# Altium schematic sheet DAC.SchDoc: Наименование
size 209 x 297 mm; ApprovedBy: Утвердил; CheckedBy: Проверил; Author: Разработал; CompanyName: Организация; DrawnBy: Н.Контр; Engineer: Т.Контр; SheetNumber: 1; SheetTotal: 1; PageSetup: Record=PageOptions|CenterHorizontal=True|CenterVertical=True|PrintScale=0.94|XCorrection=1.00|YCorrection=1.00|PrintKind=1|BorderSize=5000000|LeftOffset=0|BottomOffset=0|Orientation=1|PaperLength=1000|PaperWidth=1000|Scale=100|PaperSource=7|PrintQuality=-4|MediaType=1|DitherType=10|PaperKind=A4|PrintScaleMode=1; DecimalNumber: DAC; HeadOfSector: Нач. сектора; MainDevice: Перв.примен.; Name: Наименование; DocumentName: Sheet1.SCHDOC
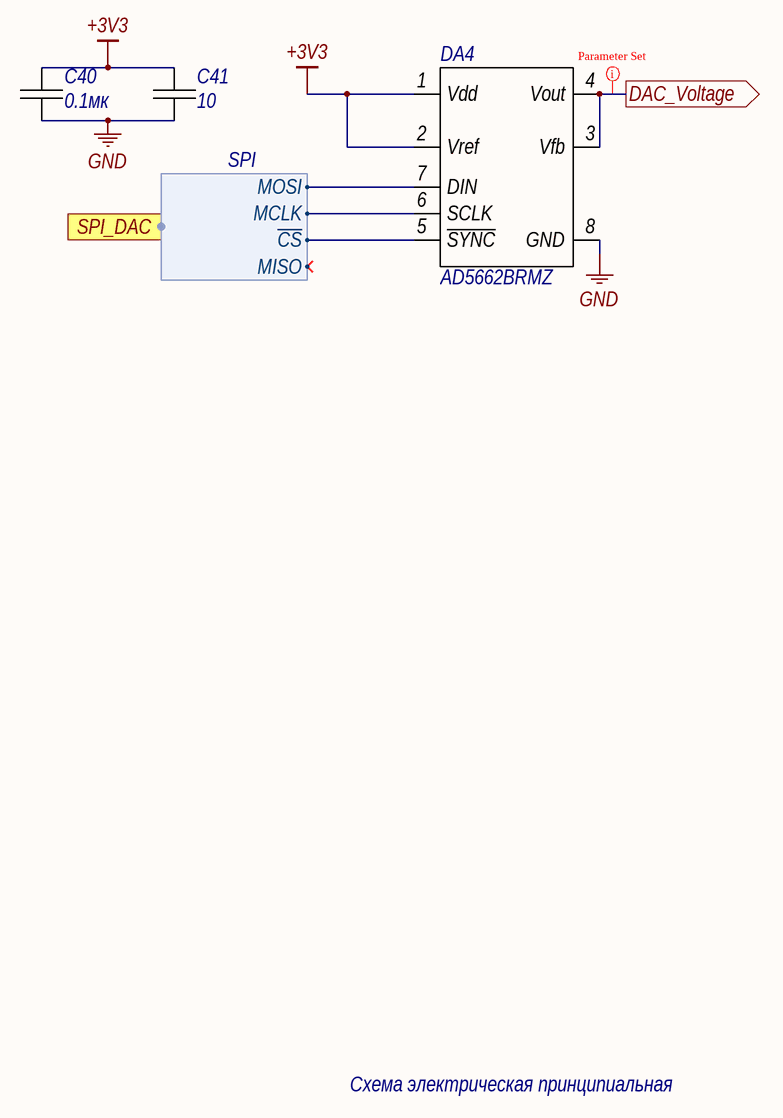
[diagram p0: DAC.SchDoc]

## Parts
C40  value 0.1мк  [CAP0402]  (hidden comment: 0.1мк 50V)
C41  value 10  [CAP0402]  (hidden comment: 10 50V)
DA4  AD5662BRMZ  [TSOP65P490X110-8N]

## Ports
DAC_Voltage (out), SPI_DAC (harness SPI)

## Harnesses
SPI: ~{CS}, MCLK, MISO, MOSI

## Nets
+3V3: C40.2 C41.2 DA4.1(Vdd) DA4.2(Vref)
GND: C40.1 C41.1 DA4.8(GND)
DAC_Voltage: DA4.3(Vfb) DA4.4(Vout) ; port DAC_Voltage
NetDA4_5: DA4.5(~{SYNC}) ; port SPI_DAC.~{CS}
NetDA4_6: DA4.6(SCLK) ; port SPI_DAC.MCLK
NetDA4_7: DA4.7(DIN) ; port SPI_DAC.MOSI

## Layout directives
net class Signal: DAC_Voltage

## Notes on the sheet
- Схема электрическая принципиальная
- Подп. и дата
- Инв.№ дубл.
- Взам.инв.№
- Подп.и дата
- Инв.№ подл.
- Изм.
- Лист
- № докум.
- Подп.
- Дата
- Формат  A4

## Library data of the parts
C40 = CAP0402: Manufacturer: Samsung Electro-Mechanics; ManufacturerAlt: JLCPCB; MPN: CL05B104KB54PNC; MPNAlt: C307331; MntType: SMD; Notes: Basic Part; Tolerance: 10%; Height: 0.5mm; MSL: MSL 1; Package: =Footprint; RoHS: Comply; Weight: 1.500mg; PartType: CHIP CERAMIC CAPACITOR; Pins: 2; BOMDescription: =MntType+' '+PartType+' '+Package+' '+Value+' '+Tolerance+' '+Voltage+' '+TempCoeff+' '+MPN; CFootprint: =Footprint; Voltage: 50V; Part Number: CAP0402; ClassName: Capacitor; ComponentLink1Description: Datasheet; ComponentLink1Description: New link; ComponentLink1URL: https://datasheet.lcsc.com/lcsc/1810191222_Samsung-Electro-Mechanics-CL05B104KB54PNC_C307331.pdf
C41 = CAP0402: Manufacturer: Samsung Electro-Mechanics; ManufacturerAlt: JLCPCB; MPN: CL05C100JB5NNNC; MPNAlt: C32949; MntType: SMD; MSL: MSL 1; Package: =Footprint; RoHS: Comply; PartType: CHIP CERAMIC CAPACITOR; Pins: 2; BOMDescription: =MntType+' '+PartType+' '+Package+' '+Value+' '+Tolerance+' '+Voltage+' '+TempCoeff+' '+MPN; CFootprint: =Footprint; Voltage: 50V; Part Number: CAP0402; ClassName: Capacitor; ComponentLink1Description: Datasheet
DA4 = AD5662: Manufacturer: Analog Devices; Value: AD5662; MntType: SMD; MPN: AD5662BRMZ; Part Number: AD5662; MSL: MSL 1; Package: MSOP-8; RoHS: Comply; PartType: DAC; Pins: 8; BOMDescription: =MntType+' '+PartType+' '+Package+' '+Value+' '+Tolerance+' '+Voltage+' '+TempCoeff+' '+MPN; CFootprint: =Footprint; ClassName: DAC; ComponentLink1Description: Datasheet; ComponentLink1URL: https://www.analog.com/media/en/technical-documentation/data-sheets/AD5662.pdf